# Altium schematic sheet mcu.SchDoc
size A4
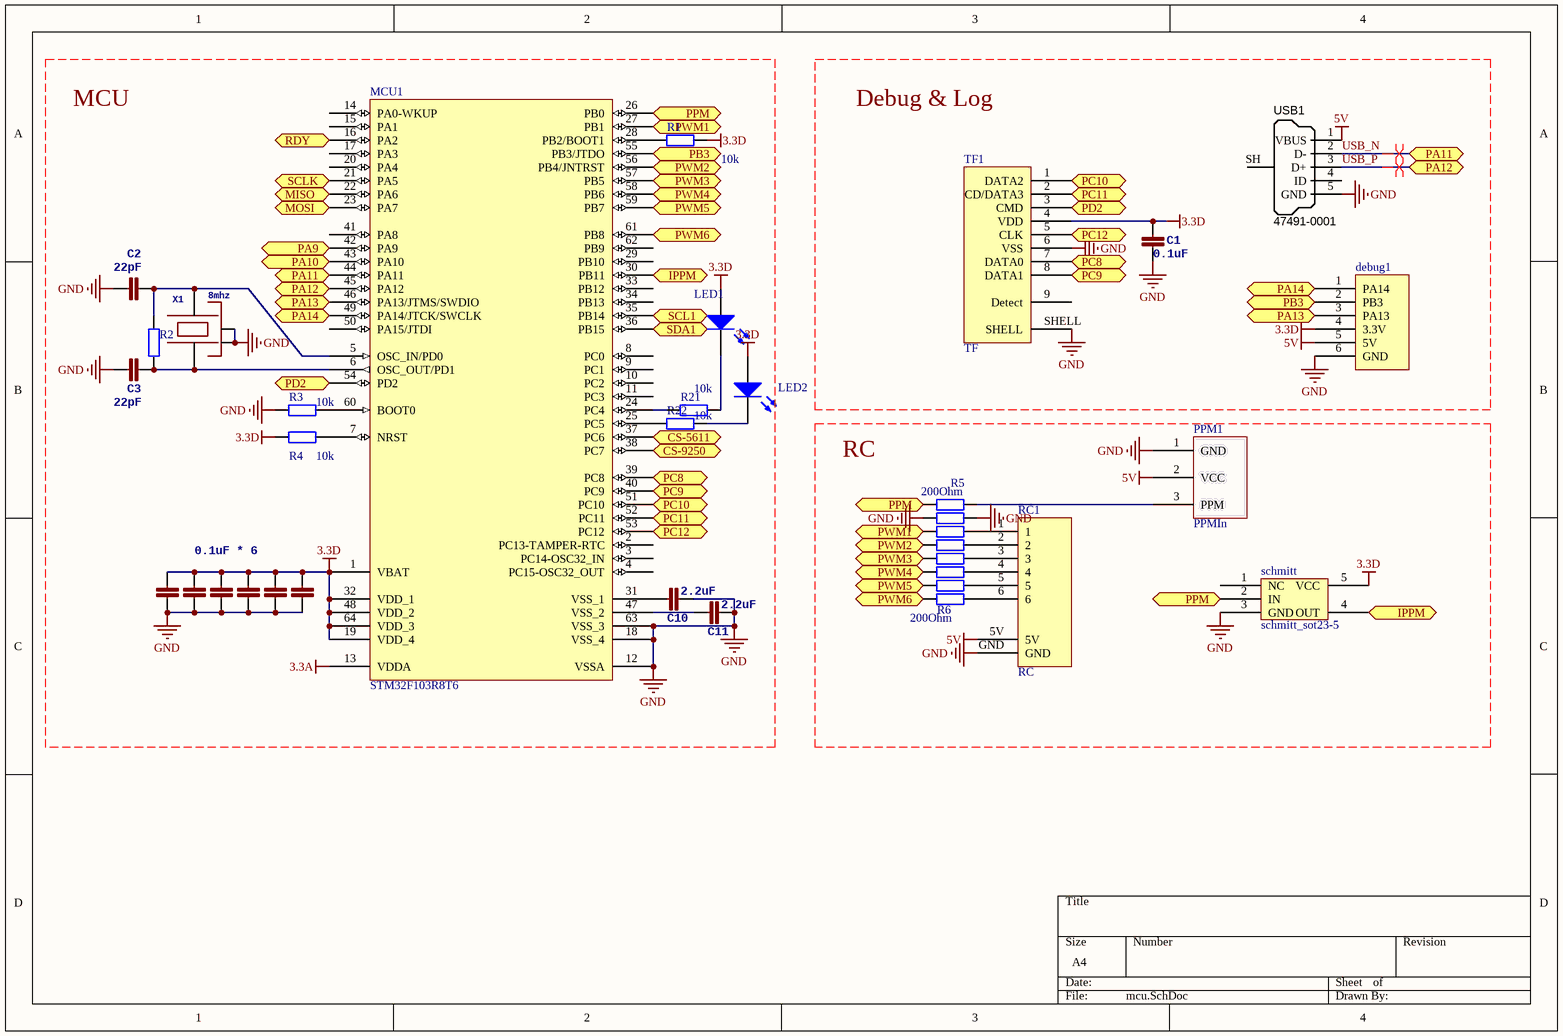
[diagram p0: mcu.SchDoc]

## Parts
C1  0.1uF  [0402]
C2  22pF  [0402]
C3  22pF  [0402]
C4  0.1uF * 6  [0402]
C5  1n  [0402]  (value not drawn)
C6  1n  [0402]  (value not drawn)
C7  1n  [0402]  (value not drawn)
C8  1n  [0402]  (value not drawn)
C9  1n  [0402]  (value not drawn)
C10  2.2uF  [0603]
C11  2.2uF  [0603]
debug1  debug  [WFRSM125]  (value not drawn)
LED1  LED0  [0603]  (value not drawn)
LED2  LED0  [0603]  (value not drawn)
MCU1  STM32F103R8T6  [LQFP64_N]
PPM1  PPMIn  [ServoConnector]
R1  10k  [0402]
R2  (no value)  [0402]
R3  10k  [0402]
R4  10k  [0402]
R5  value 200Ohm  [0402X4]  (hidden comment: Res*4)
R6  value 200Ohm  [0402X4]  (hidden comment: Res*4)
R21  10k  [0402]
R22  10k  [0402]
RC1  RC  [6P]
schmitt  schmitt_sot23-5  [SOT23-5]
TF1  TF  [TF]
USB1  Manufacturer Part Number 1: 47491-0001  [MOLEX-47346-0001]  (hidden comment: USB Micro Type B)
X1  8mhz  [OSCILLATOR-3.2X2.5]

## Ports
CS-5611, CS-9250, IPPM, MISO, MOSI, PA9, PA10, PA11, PA12, PA13, PA14, PB3, PC8, PC9, PC10, PC11, PC12, PD2, PPM, PWM1, PWM2, PWM3, PWM4, PWM5, PWM6, RDY, SCL1, SCLK, SDA1

## Nets
3.3A: MCU1.13(VDDA)
3.3D: C1.2 C4.2 C5.2 C6.2 C7.2 C8.2 C9.2 debug1.4(3.3V) LED1.1(A) LED2.1(A) MCU1.1(VBAT) MCU1.19(VDD_4) MCU1.32(VDD_1) MCU1.48(VDD_2) MCU1.64(VDD_3) R1.2 R4.2 schmitt.5(VCC) TF1.4(VDD)
5V: debug1.5(5V) PPM1.2(VCC) RC1.5V USB1.1(VBUS)
GND: C1.1 C2.2 C3.2 C4.1 C5.1 C6.1 C7.1 C8.1 C9.1 C10.2 C11.2 debug1.6(GND) MCU1.12(VSSA) MCU1.18(VSS_4) MCU1.63(VSS_3) PPM1.1(GND) R3.1 R5.2 R5.7 RC1.GND schmitt.3(GND) TF1.6(VSS) TF1.SHELL USB1.5(GND) X1.2(NC_2) X1.4(NC_4)
CS-5611: MCU1.37(PC6) ; port CS-5611
CS-9250: MCU1.38(PC7) ; port CS-9250
IPPM: MCU1.30(PB11) schmitt.4(OUT) ; port IPPM
MISO: MCU1.22(PA6) ; port MISO
MOSI: MCU1.23(PA7) ; port MOSI
PA9: MCU1.42(PA9) ; port PA9
PA10: MCU1.43(PA10) ; port PA10
PA13: debug1.3(PA13) MCU1.46(PA13/JTMS/SWDIO) ; port PA13
PA14: debug1.1(PA14) MCU1.49(PA14/JTCK/SWCLK) ; port PA14
PB3: debug1.2(PB3) MCU1.55(PB3/JTDO) ; port PB3
PC8: MCU1.39(PC8) TF1.7(DATA0) ; port PC8
PC9: MCU1.40(PC9) TF1.8(DATA1) ; port PC9
PC10: MCU1.51(PC10) TF1.1(DATA2) ; port PC10
PC11: MCU1.52(PC11) TF1.2(CD/DATA3) ; port PC11
PC12: MCU1.53(PC12) TF1.5(CLK) ; port PC12
PD2: MCU1.54(PD2) TF1.3(CMD) ; port PD2
PPM: MCU1.26(PB0) R5.1 schmitt.2(IN) ; port PPM
PWM1: MCU1.27(PB1) R5.3 ; port PWM1
PWM2: MCU1.56(PB4/JNTRST) R5.4 ; port PWM2
PWM3: MCU1.57(PB5) R6.1 ; port PWM3
PWM4: MCU1.58(PB6) R6.2 ; port PWM4
PWM5: MCU1.59(PB7) R6.3 ; port PWM5
PWM6: MCU1.61(PB8) R6.4 ; port PWM6
RDY: MCU1.16(PA2) ; port RDY
SCL1: MCU1.35(PB14) ; port SCL1
SCLK: MCU1.21(PA5) ; port SCLK
SDA1: MCU1.36(PB15) ; port SDA1
USB_N: MCU1.44(PA11) USB1.2(D-) ; port PA11
USB_P: MCU1.45(PA12) USB1.3(D+) ; port PA12
NetC2_1: C2.1 MCU1.5(OSC_IN/PD0) R2.2 X1.3
NetC3_1: C3.1 MCU1.6(OSC_OUT/PD1) R2.1 X1.1
NetC10_1: C10.1 MCU1.31(VSS_1)
NetC11_1: C11.1 MCU1.47(VSS_2)
NetLED1_2: LED1.2(K) R21.2
NetLED2_2: LED2.2(K) R22.2
NetMCU1_7: MCU1.7(NRST) R4.1
NetMCU1_24: MCU1.24(PC4) R21.1
NetMCU1_25: MCU1.25(PC5) R22.1
NetMCU1_28: MCU1.28(PB2/BOOT1) R1.1
NetMCU1_60: MCU1.60(BOOT0) R3.2
NetPPM1_3: PPM1.3(PPM) R5.8
NetR5_5: R5.5 RC1.2
NetR5_6: R5.6 RC1.1
NetR6_5: R6.5 RC1.6
NetR6_6: R6.6 RC1.5
NetR6_7: R6.7 RC1.4
NetR6_8: R6.8 RC1.3

Not connected (* = marked no-connect by the designer): MCU1 2(PC13-TAMPER-RTC) 3(PC14-OSC32_IN) 4(PC15-OSC32_OUT) 8(PC0) 9(PC1) 10(PC2) 11(PC3) 14(PA0-WKUP) 15(PA1) 17(PA3) 20(PA4) 29(PB10) 33(PB12) 34(PB13) 41(PA8) 50(PA15/JTDI) 62(PB9); schmitt 1(NC); TF1 9(Detect); USB1 4(ID) SH(Shell)

## Layout directives
differential pair: USB_N, USB_P

## Notes on the sheet
- MCU
- Debug & Log
- RC

## Library data of the parts
C1-C11 = CAP0402-CAP: <b>Capacitor</b> / Standard 0603 ceramic capacitor, and 0.1" leaded capacitor.; PARTNO: CC0402ZRY5V7BB104
LED1 LED2 = LED0: Typical INFRARED GaAs LED; Published: 8-Jun-2000; LatestRevisionDate: 08-Jul-2005; LatestRevisionNote: Mech Layer 1 removed.; PackageReference: LED-0; Publisher: Altium Limited; PackageDescription: LED; 2 Leads
MCU1 = STM32F103R8T6: STM32 ARM-based 32-bit MCU with 64 Kbytes Flash, 64-pin LQFP, Industrial Temperature; Published: *; DatasheetVersion: *; PackageVersion: *; PackageReference: *; Publisher: *; PackageDescription: *; ComponentLink1Description: *; ComponentLink1URL: *; ComponentLink2Description: *; ComponentLink2URL: *
R1-R4 R21 R22 = Res2: Resistor; Value: 0Ohm; Published: 8-Jun-2000; LatestRevisionDate: 17-Jul-2002; LatestRevisionNote: Re-released for DXP Platform.; PackageReference: AXIAL-0.4; Publisher: Altium Limited; PackageDescription: Axial Device, Thru-Hole; 2 Leads; 0.4 in Pin Spacing
R5 R6 = Res*4: Resistor; Published: 8-Jun-2000; LatestRevisionDate: 17-Jul-2002; LatestRevisionNote: Re-released for DXP Platform.; PackageReference: AXIAL-0.4; Publisher: Altium Limited; PackageDescription: Axial Device, Thru-Hole; 2 Leads; 0.4 in Pin Spacing
USB1 = USB_Micro_TypeB: Connector SMD USB Micro Type B middle mount; Manufacturer 1: Molex Inc; SCDType: undef; Package / Case: SMD; Supplier 1: Digi-Key; Supplier Part Number 1: WM17142CT-ND
X1 = OSCILLATOR-3.2X2.5: Crystal Oscillator in 3.2x2.5 SMD